# Altium schematic sheet SoC_SDIO.SchDoc
size A3; SheetNumber: 5; SheetTotal: 6
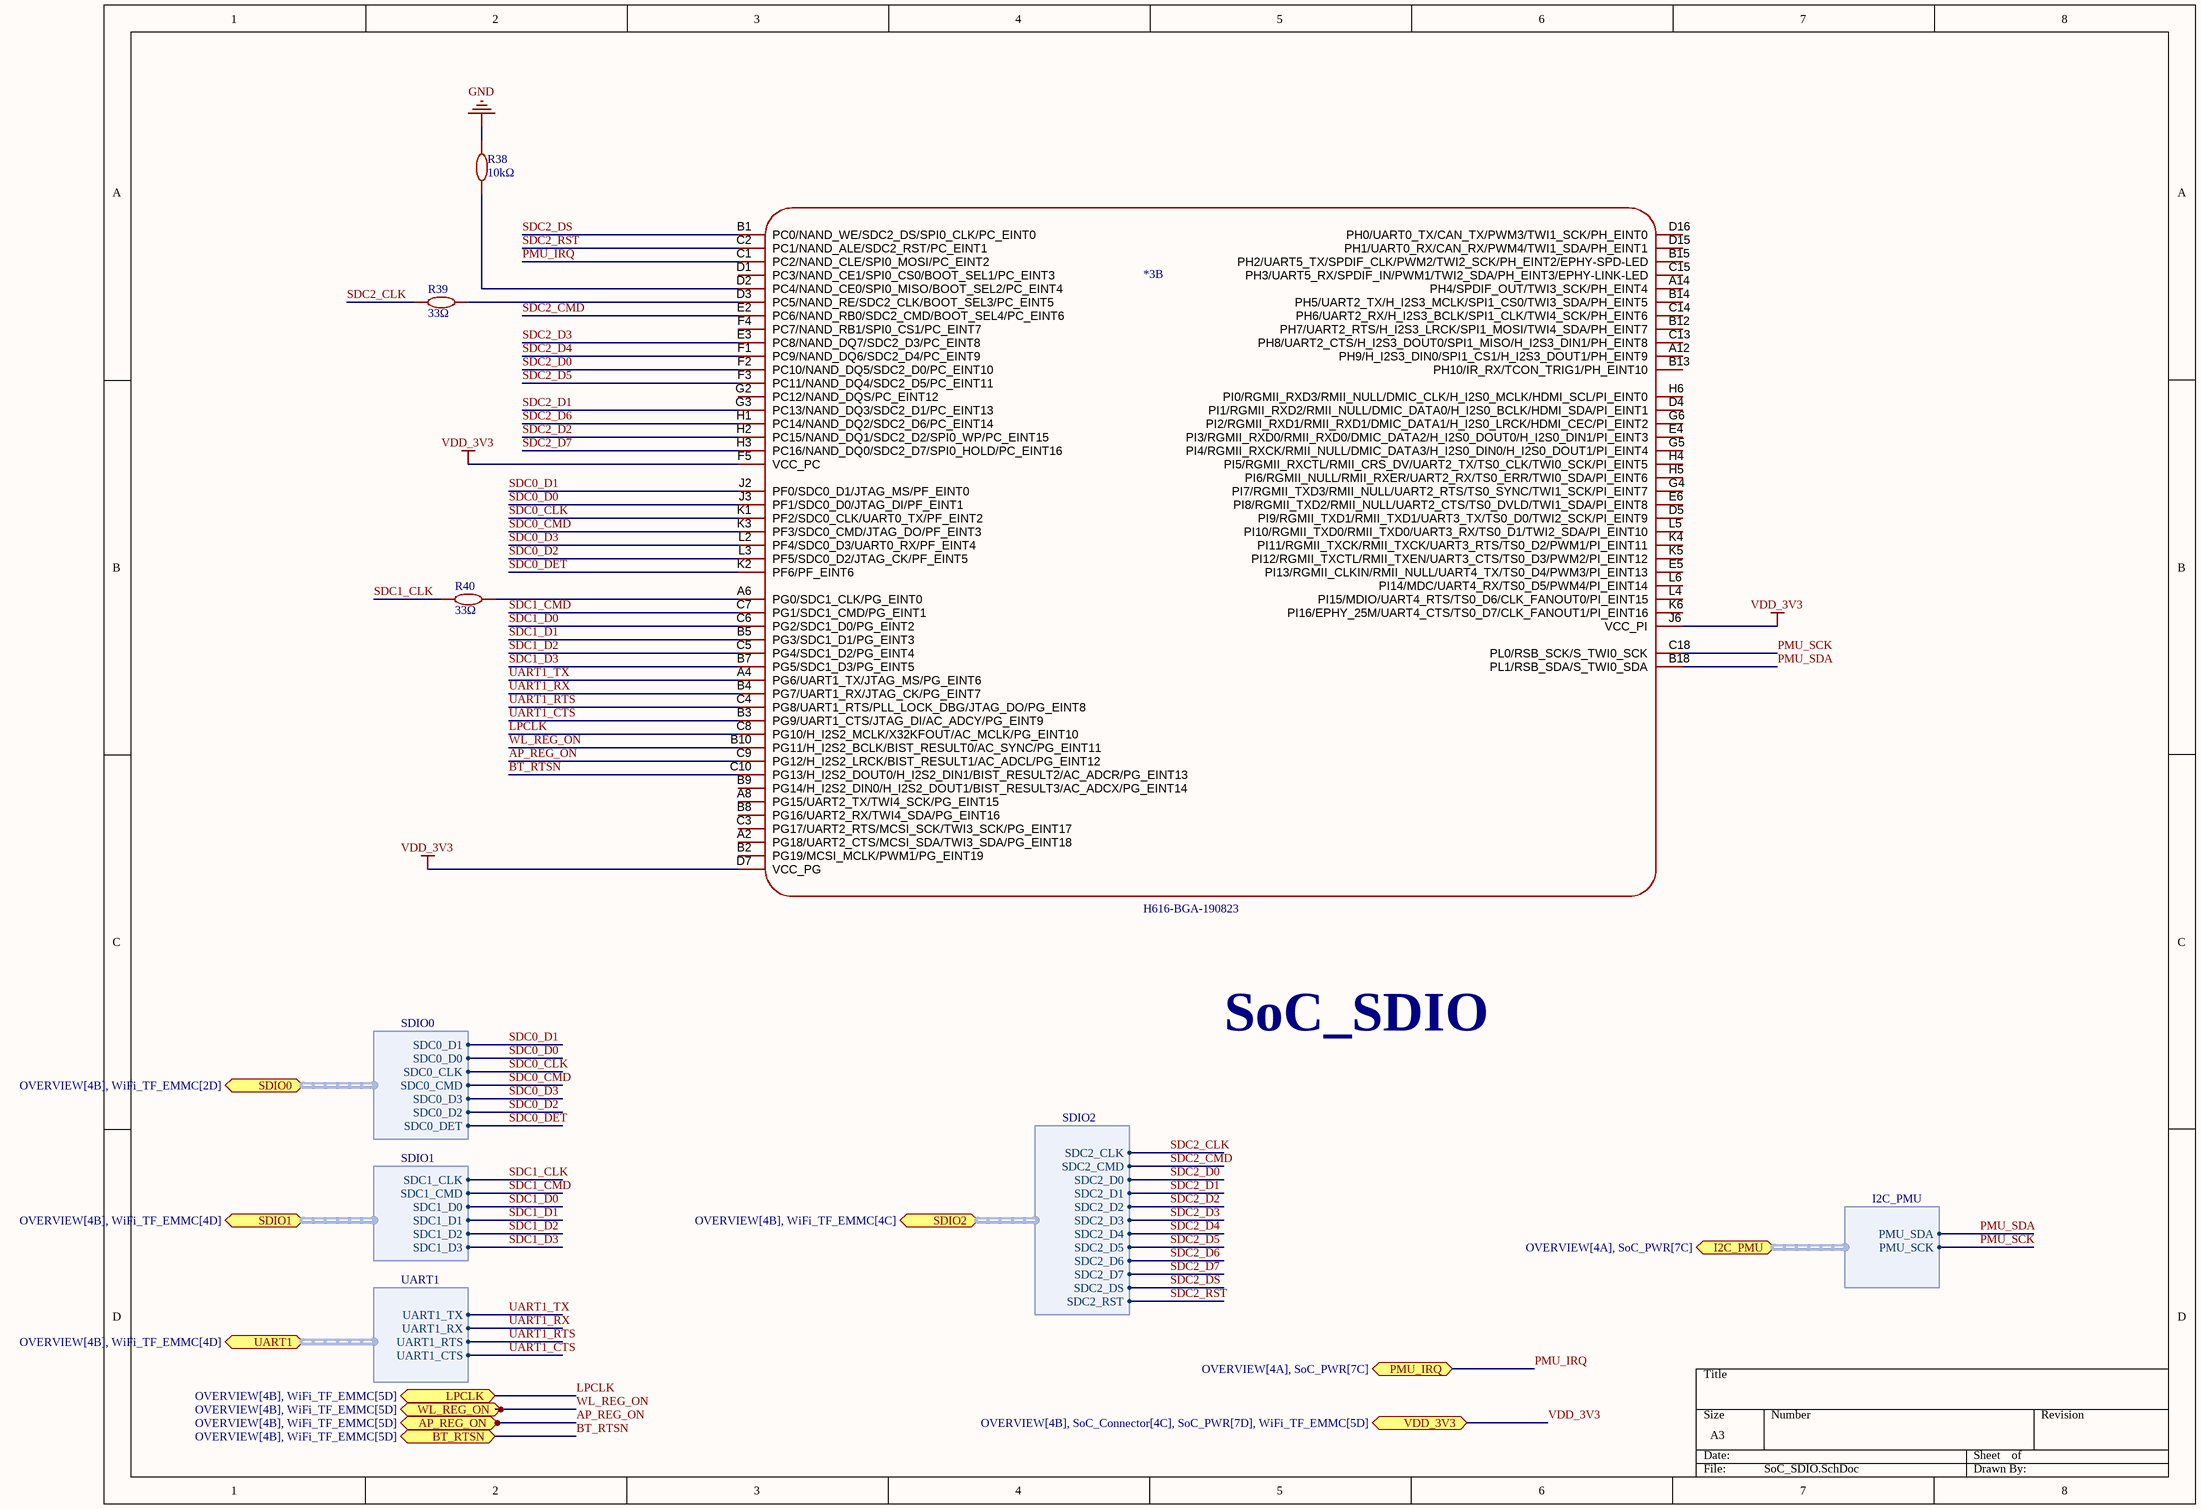
[diagram p0: SoC_SDIO.SchDoc]

## Parts
*3  H616-BGA-190823  [BGA-284_L14.0-W12.0-P0.65-TL]  (part B of 4)
R38  10kΩ  [R0402]
R39  33Ω  [R0402]
R40  33Ω  [R0402]

## Ports
AP_REG_ON (bidir, see OVERVIEW[4B], WiFi_TF_EMMC[5D]), BT_RTSN (bidir, see OVERVIEW[4B], WiFi_TF_EMMC[5D]), I2C_PMU (bidir, harness I2C_PMU, see OVERVIEW[4A], SoC_PWR[7C]), LPCLK (bidir, see OVERVIEW[4B], WiFi_TF_EMMC[5D]), PMU_IRQ (bidir, see OVERVIEW[4A], SoC_PWR[7C]), SDIO0 (bidir, harness SDIO0, see OVERVIEW[4B], WiFi_TF_EMMC[2D]), SDIO1 (bidir, harness SDIO1, see OVERVIEW[4B], WiFi_TF_EMMC[4D]), SDIO2 (bidir, harness SDIO2, see OVERVIEW[4B], WiFi_TF_EMMC[4C]), UART1 (bidir, harness UART1, see OVERVIEW[4B], WiFi_TF_EMMC[4D]), VDD_3V3 (bidir, see OVERVIEW[4B], SoC_Connector[4C], SoC_PWR[7D], WiFi_TF_EMMC[5D]), WL_REG_ON (bidir, see OVERVIEW[4B], WiFi_TF_EMMC[5D])

## Harnesses
SDIO1: SDC1_D0, SDC1_D1, SDC1_CMD, SDC1_D2, SDC1_D3, SDC1_CLK
UART1: UART1_RX, UART1_RTS, UART1_TX, UART1_CTS
SDIO0: SDC0_CLK, SDC0_CMD, SDC0_D0, SDC0_D3, SDC0_D2, SDC0_D1, SDC0_DET
I2C_PMU: PMU_SDA, PMU_SCK
SDIO2: SDC2_D2, SDC2_D3, SDC2_D1, SDC2_D4, SDC2_D5, SDC2_D0, SDC2_CMD, SDC2_CLK, SDC2_D6, SDC2_D7, SDC2_DS, SDC2_RST

## Nets
GND: R38.2
VDD_3V3: *3.D7(VCC_PG) *3.F5(VCC_PC) *3.J6(VCC_PI) ; port VDD_3V3
AP_REG_ON: *3.C9(PG12/H_I2S2_LRCK/BIST_RESULT1/AC_ADCL/PG_EINT12) ; port AP_REG_ON
BT_RTSN: *3.C10(PG13/H_I2S2_DOUT0/H_I2S2_DIN1/BIST_RESULT2/AC_ADCR/PG_EINT13) ; port BT_RTSN
LPCLK: *3.C8(PG10/H_I2S2_MCLK/X32KFOUT/AC_MCLK/PG_EINT10) ; port LPCLK
PMU_IRQ: *3.C1(PC2/NAND_CLE/SPI0_MOSI/PC_EINT2) ; port PMU_IRQ
PMU_SCK: *3.C18(PL0/RSB_SCK/S_TWI0_SCK) ; port I2C_PMU.PMU_SCK
PMU_SDA: *3.B18(PL1/RSB_SDA/S_TWI0_SDA) ; port I2C_PMU.PMU_SDA
SDC0_CLK: *3.K1(PF2/SDC0_CLK/UART0_TX/PF_EINT2) ; port SDIO0.SDC0_CLK
SDC0_CMD: *3.K3(PF3/SDC0_CMD/JTAG_DO/PF_EINT3) ; port SDIO0.SDC0_CMD
SDC0_D0: *3.J3(PF1/SDC0_D0/JTAG_DI/PF_EINT1) ; port SDIO0.SDC0_D0
SDC0_D1: *3.J2(PF0/SDC0_D1/JTAG_MS/PF_EINT0) ; port SDIO0.SDC0_D1
SDC0_D2: *3.L3(PF5/SDC0_D2/JTAG_CK/PF_EINT5) ; port SDIO0.SDC0_D2
SDC0_D3: *3.L2(PF4/SDC0_D3/UART0_RX/PF_EINT4) ; port SDIO0.SDC0_D3
SDC0_DET: *3.K2(PF6/PF_EINT6) ; port SDIO0.SDC0_DET
SDC1_CLK: R40.1 ; port SDIO1.SDC1_CLK
SDC1_CMD: *3.C7(PG1/SDC1_CMD/PG_EINT1) ; port SDIO1.SDC1_CMD
SDC1_D0: *3.C6(PG2/SDC1_D0/PG_EINT2) ; port SDIO1.SDC1_D0
SDC1_D1: *3.B5(PG3/SDC1_D1/PG_EINT3) ; port SDIO1.SDC1_D1
SDC1_D2: *3.C5(PG4/SDC1_D2/PG_EINT4) ; port SDIO1.SDC1_D2
SDC1_D3: *3.B7(PG5/SDC1_D3/PG_EINT5) ; port SDIO1.SDC1_D3
SDC2_CLK: R39.1 ; port SDIO2.SDC2_CLK
SDC2_CMD: *3.E2(PC6/NAND_RB0/SDC2_CMD/BOOT_SEL4/PC_EINT6) ; port SDIO2.SDC2_CMD
SDC2_D0: *3.F2(PC10/NAND_DQ5/SDC2_D0/PC_EINT10) ; port SDIO2.SDC2_D0
SDC2_D1: *3.G3(PC13/NAND_DQ3/SDC2_D1/PC_EINT13) ; port SDIO2.SDC2_D1
SDC2_D2: *3.H2(PC15/NAND_DQ1/SDC2_D2/SPI0_WP/PC_EINT15) ; port SDIO2.SDC2_D2
SDC2_D3: *3.E3(PC8/NAND_DQ7/SDC2_D3/PC_EINT8) ; port SDIO2.SDC2_D3
SDC2_D4: *3.F1(PC9/NAND_DQ6/SDC2_D4/PC_EINT9) ; port SDIO2.SDC2_D4
SDC2_D5: *3.F3(PC11/NAND_DQ4/SDC2_D5/PC_EINT11) ; port SDIO2.SDC2_D5
SDC2_D6: *3.H1(PC14/NAND_DQ2/SDC2_D6/PC_EINT14) ; port SDIO2.SDC2_D6
SDC2_D7: *3.H3(PC16/NAND_DQ0/SDC2_D7/SPI0_HOLD/PC_EINT16) ; port SDIO2.SDC2_D7
SDC2_DS: *3.B1(PC0/NAND_WE/SDC2_DS/SPI0_CLK/PC_EINT0) ; port SDIO2.SDC2_DS
SDC2_RST: *3.C2(PC1/NAND_ALE/SDC2_RST/PC_EINT1) ; port SDIO2.SDC2_RST
UART1_CTS: *3.B3(PG9/UART1_CTS/JTAG_DI/AC_ADCY/PG_EINT9) ; port UART1.UART1_CTS
UART1_RTS: *3.C4(PG8/UART1_RTS/PLL_LOCK_DBG/JTAG_DO/PG_EINT8) ; port UART1.UART1_RTS
UART1_RX: *3.B4(PG7/UART1_RX/JTAG_CK/PG_EINT7) ; port UART1.UART1_RX
UART1_TX: *3.A4(PG6/UART1_TX/JTAG_MS/PG_EINT6) ; port UART1.UART1_TX
WL_REG_ON: *3.B10(PG11/H_I2S2_BCLK/BIST_RESULT0/AC_SYNC/PG_EINT11) ; port WL_REG_ON
Net*3_A6: *3.A6(PG0/SDC1_CLK/PG_EINT0) R40.2
Net*3_D2: *3.D2(PC4/NAND_CE0/SPI0_MISO/BOOT_SEL2/PC_EINT4) R38.1
Net*3_D3: *3.D3(PC5/NAND_RE/SDC2_CLK/BOOT_SEL3/PC_EINT5) R39.2

Not connected (* = marked no-connect by the designer): *3 A2(PG18/UART2_CTS/MCSI_SDA/TWI3_SDA/PG_EINT18) A8(PG15/UART2_TX/TWI4_SCK/PG_EINT15) A12(PH9/H_I2S3_DIN0/SPI1_CS1/H_I2S3_DOUT1/PH_EINT9) A14(PH4/SPDIF_OUT/TWI3_SCK/PH_EINT4) B2(PG19/MCSI_MCLK/PWM1/PG_EINT19) B8(PG16/UART2_RX/TWI4_SDA/PG_EINT16) B9(PG14/H_I2S2_DIN0/H_I2S2_DOUT1/BIST_RESULT3/AC_ADCX/PG_EINT14) B12(PH7/UART2_RTS/H_I2S3_LRCK/SPI1_MOSI/TWI4_SDA/PH_EINT7) B13(PH10/IR_RX/TCON_TRIG1/PH_EINT10) B14(PH5/UART2_TX/H_I2S3_MCLK/SPI1_CS0/TWI3_SDA/PH_EINT5) B15(PH2/UART5_TX/SPDIF_CLK/PWM2/TWI2_SCK/PH_EINT2/EPHY-SPD-LED) C3(PG17/UART2_RTS/MCSI_SCK/TWI3_SCK/PG_EINT17) C13(PH8/UART2_CTS/H_I2S3_DOUT0/SPI1_MISO/H_I2S3_DIN1/PH_EINT8) C14(PH6/UART2_RX/H_I2S3_BCLK/SPI1_CLK/TWI4_SCK/PH_EINT6) C15(PH3/UART5_RX/SPDIF_IN/PWM1/TWI2_SDA/PH_EINT3/EPHY-LINK-LED) D1(PC3/NAND_CE1/SPI0_CS0/BOOT_SEL1/PC_EINT3) D4(PI1/RGMII_RXD2/RMII_NULL/DMIC_DATA0/H_I2S0_BCLK/HDMI_SDA/PI_EINT1) D5(PI9/RGMII_TXD1/RMII_TXD1/UART3_TX/TS0_D0/TWI2_SCK/PI_EINT9) D15(PH1/UART0_RX/CAN_RX/PWM4/TWI1_SDA/PH_EINT1) D16(PH0/UART0_TX/CAN_TX/PWM3/TWI1_SCK/PH_EINT0) E4(PI3/RGMII_RXD0/RMII_RXD0/DMIC_DATA2/H_I2S0_DOUT0/H_I2S0_DIN1/PI_EINT3) E5(PI13/RGMII_CLKIN/RMII_NULL/UART4_TX/TS0_D4/PWM3/PI_EINT13) E6(PI8/RGMII_TXD2/RMII_NULL/UART2_CTS/TS0_DVLD/TWI1_SDA/PI_EINT8) F4(PC7/NAND_RB1/SPI0_CS1/PC_EINT7) G2(PC12/NAND_DQS/PC_EINT12) G4(PI7/RGMII_TXD3/RMII_NULL/UART2_RTS/TS0_SYNC/TWI1_SCK/PI_EINT7) G5(PI4/RGMII_RXCK/RMII_NULL/DMIC_DATA3/H_I2S0_DIN0/H_I2S0_DOUT1/PI_EINT4) G6(PI2/RGMII_RXD1/RMII_RXD1/DMIC_DATA1/H_I2S0_LRCK/HDMI_CEC/PI_EINT2) H4(PI5/RGMII_RXCTL/RMII_CRS_DV/UART2_TX/TS0_CLK/TWI0_SCK/PI_EINT5) H5(PI6/RGMII_NULL/RMII_RXER/UART2_RX/TS0_ERR/TWI0_SDA/PI_EINT6) H6(PI0/RGMII_RXD3/RMII_NULL/DMIC_CLK/H_I2S0_MCLK/HDMI_SCL/PI_EINT0) K4(PI11/RGMII_TXCK/RMII_TXCK/UART3_RTS/TS0_D2/PWM1/PI_EINT11) K5(PI12/RGMII_TXCTL/RMII_TXEN/UART3_CTS/TS0_D3/PWM2/PI_EINT12) K6(PI16/EPHY_25M/UART4_CTS/TS0_D7/CLK_FANOUT1/PI_EINT16) L4(PI15/MDIO/UART4_RTS/TS0_D6/CLK_FANOUT0/PI_EINT15) L5(PI10/RGMII_TXD0/RMII_TXD0/UART3_RX/TS0_D1/TWI2_SDA/PI_EINT10) L6(PI14/MDC/UART4_RX/TS0_D5/PWM4/PI_EINT14)

## Notes on the sheet
- SoC_SDIO

## Library data of the parts
*3 = H616-BGA-190823: Allwinner H616; Symbol: H616-BGA-190823
R38 = 10kΩ: 62.5mW 10kΩ 50V ±100ppm/℃ Thick Film Resistor ±1% 0402 Chip Resistor - Surface Mount ROHS
R39 R40 = 33Ω: 62.5mW 33Ω 50V ±100ppm/℃ Thick Film Resistor ±1% 0402 Chip Resistor - Surface Mount ROHS